# Altium schematic sheet Page10 WIFI&Bluetooth.SchDoc
size 386 x 246 mm
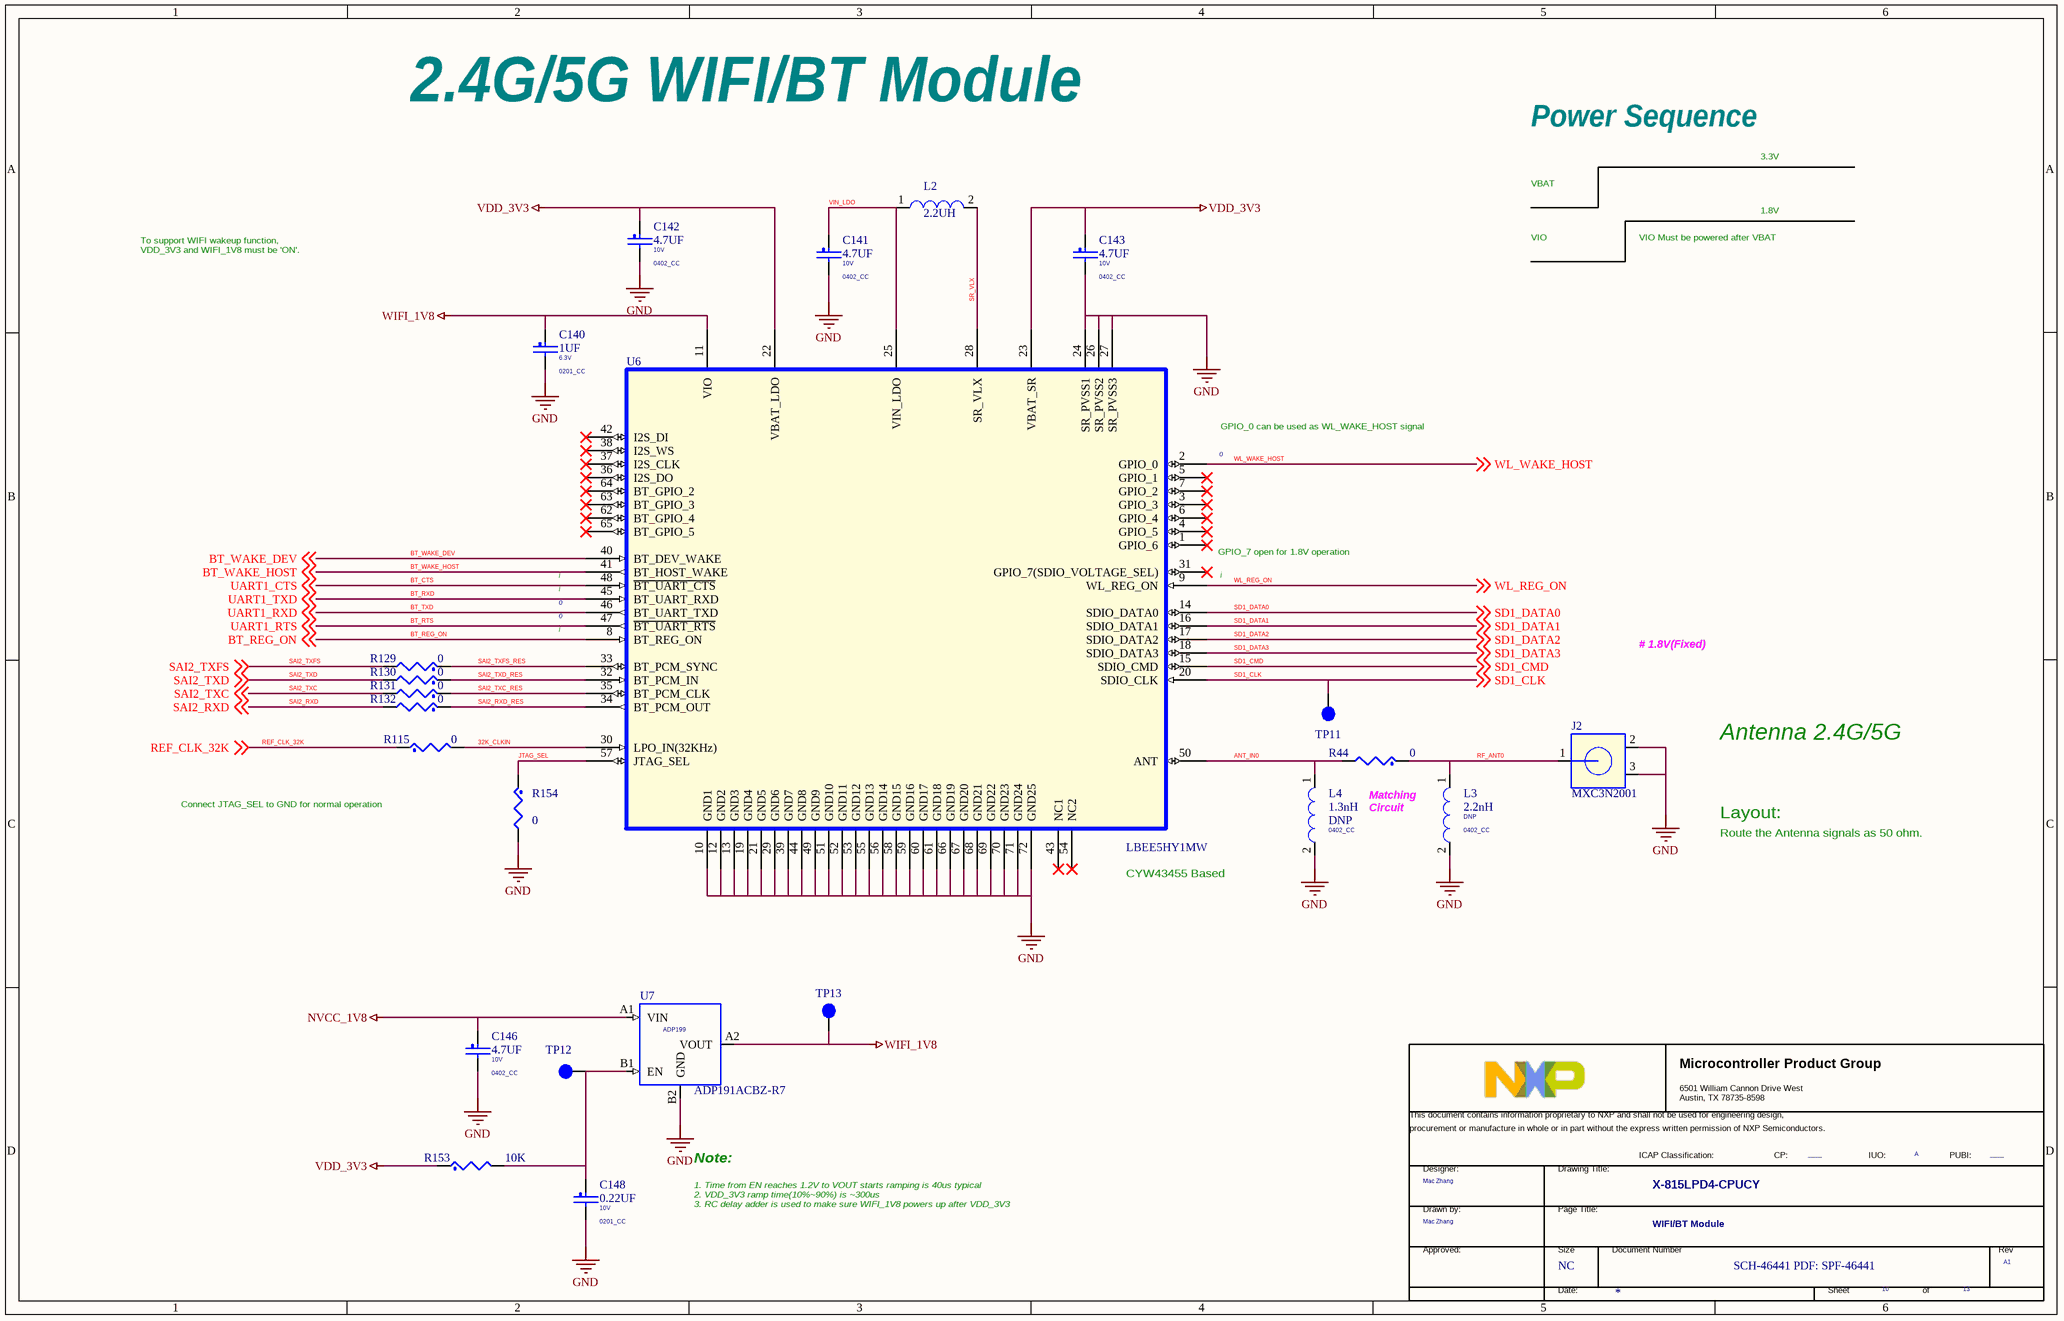
[diagram p0: Page10 WIFI&Bluetooth.SchDoc]

## Parts
*  Doc: SCH-46441 PDF: SPF-46441  RevCode: A1  Title: X-815LPD4-CPUCY  Page Size: NC  Page Number: 10  Page Count: 13  PageTitle: WIFI/BT Module  Designer: Mac Zhang  PUBI: ____  FIUO: A  (hidden comment: TitleBlock_MCPG)  (graphical)
C140  1UF  VOLTAGE: 6.3V  [0201_CC]
C141  4.7UF  VOLTAGE: 10V  [0402_CC]
C142  4.7UF  VOLTAGE: 10V  [0402_CC]
C143  4.7UF  VOLTAGE: 10V  [0402_CC]
C146  4.7UF  VOLTAGE: 10V  [0402_CC]
C148  0.22UF  VOLTAGE: 10V  [0201_CC]
J2  MXC3N2001  [CON_3_UFL_R_SMT]
L2  2.2UH  [IND_0603A]
L3  2.2nH  ASSY_OPT: DNP  [0402_CC]
L4  1.3nH  ASSY_OPT: DNP  [0402_CC]
R44  0  [0402_CC]
R115  0  [0402_CC]
R129  0  [0402_CC]
R130  0  [0402_CC]
R131  0  [0402_CC]
R132  0  [0402_CC]
R153  10K  [0201_CC]
R154  0  [0402_CC]
TP11  TPAD_015  [TPAD_015]  (value not drawn)
TP12  tpad_020  [tpad_020]  (value not drawn)
TP13  tpad_020  [tpad_020]  (value not drawn)
U6  LBEE5HY1MW  [lga72_0p5_7p9x7p3]
U7  ADP191ACBZ-R7  [wlcsp4_0p4_0p8x0p8_smdp]

## Nets
GND: C140.2 C141.2 C142.2 C143.2 C146.2 C148.2 J2.2(GND1) J2.3(GND2) L3.2 L4.2 R154.2 U6.10(GND1) U6.12(GND2) U6.13(GND3) U6.19(GND4) U6.21(GND5) U6.24(SR_PVSS1) U6.26(SR_PVSS2) U6.27(SR_PVSS3) U6.29(GND6) U6.39(GND7) U6.44(GND8) U6.49(GND9) U6.51(GND10) U6.52(GND11) U6.53(GND12) U6.55(GND13) U6.56(GND14) U6.58(GND15) U6.59(GND16) U6.60(GND17) U6.61(GND18) U6.66(GND19) U6.67(GND20) U6.68(GND21) U6.69(GND22) U6.70(GND23) U6.71(GND24) U6.72(GND25) U7.B2(GND)
NVCC_1V8: C146.1 U7.A1(VIN)
VDD_3V3: C142.1 C143.1 R153.1 U6.22(VBAT_LDO) U6.23(VBAT_SR)
WIFI_1V8: C140.1 TP13.1(Pin1) U6.11(VIO) U7.A2(VOUT)
32K_CLKIN: R115.2 U6.30(LPO_IN(32KHz))
ANT_IN0: L4.1 R44.2 U6.50(ANT)
BT_CTS: U6.48(~{BT_UART_CTS}) ; off-sheet UART1_CTS  [also labelled UART1_CTS]
BT_REG_ON: U6.8(BT_REG_ON) ; off-sheet BT_REG_ON
BT_RTS: U6.47(~{BT_UART_RTS}) ; off-sheet UART1_RTS  [also labelled UART1_RTS]
BT_RXD: U6.45(BT_UART_RXD) ; off-sheet UART1_TXD  [also labelled UART1_TXD]
BT_TXD: U6.46(BT_UART_TXD) ; off-sheet UART1_RXD  [also labelled UART1_RXD]
BT_WAKE_DEV: U6.40(BT_DEV_WAKE) ; off-sheet BT_WAKE_DEV
BT_WAKE_HOST: U6.41(BT_HOST_WAKE) ; off-sheet BT_WAKE_HOST
JTAG_SEL: R154.1 U6.57(JTAG_SEL)
REF_CLK_32K: R115.1 ; off-sheet REF_CLK_32K
RF_ANT0: J2.1(CTR) L3.1 R44.1
SAI2_RXD: R132.2 ; off-sheet SAI2_RXD
SAI2_RXD_RES: R132.1 U6.34(BT_PCM_OUT)
SAI2_TXC: R131.2 ; off-sheet SAI2_TXC
SAI2_TXC_RES: R131.1 U6.35(BT_PCM_CLK)
SAI2_TXD: R130.2 ; off-sheet SAI2_TXD
SAI2_TXD_RES: R130.1 U6.32(BT_PCM_IN)
SAI2_TXFS: R129.2 ; off-sheet SAI2_TXFS
SAI2_TXFS_RES: R129.1 U6.33(BT_PCM_SYNC)
SD1_CLK: TP11.1(Pin1) U6.20(SDIO_CLK) ; off-sheet SD1_CLK
SD1_CMD: U6.15(SDIO_CMD) ; off-sheet SD1_CMD
SD1_DATA0: U6.14(SDIO_DATA0) ; off-sheet SD1_DATA0
SD1_DATA1: U6.16(SDIO_DATA1) ; off-sheet SD1_DATA1
SD1_DATA2: U6.17(SDIO_DATA2) ; off-sheet SD1_DATA2
SD1_DATA3: U6.18(SDIO_DATA3) ; off-sheet SD1_DATA3
SR_VLX: L2.2 U6.28(SR_VLX)
VIN_LDO: C141.1 L2.1 U6.25(VIN_LDO)
WL_REG_ON: U6.9(WL_REG_ON) ; off-sheet WL_REG_ON
WL_WAKE_HOST: U6.2(GPIO_0) ; off-sheet WL_WAKE_HOST
NetC148_1: C148.1 R153.2 TP12.1(Pin1) U7.B1(EN)

Not connected (* = marked no-connect by the designer): U6 1(GPIO_6)* 3(GPIO_3)* 4(GPIO_5)* 5(GPIO_1)* 6(GPIO_4)* 7(GPIO_2)* 31(GPIO_7(SDIO_VOLTAGE_SEL))* 36(I2S_DO)* 37(I2S_CLK)* 38(I2S_WS)* 42(I2S_DI)* 43(NC1)* 54(NC2)* 62(BT_GPIO_4)* 63(BT_GPIO_3)* 64(BT_GPIO_2)* 65(BT_GPIO_5)*

## Notes on the sheet
- 2.4G/5G WIFI/BT Module
- VBAT
- Power Sequence
- 3.3V
- To support WIFI wakeup function,
  VDD_3V3 and WIFI_1V8 must be 'ON'.
- VIO
- VIO Must be powered after VBAT
- 1.8V
- (near U6) o
- GPIO_0 can be used as WL_WAKE_HOST signal
- i
- (near U6) GPIO_7 open for 1.8V operation
- o
- # 1.8V(Fixed)
- (near L3) Matching
  Circuit
- Antenna 2.4G/5G
- Layout:
- Connect JTAG_SEL to GND for normal operation
- Route the Antenna signals as 50 ohm.
- (near U6) CYW43455 Based
- 1. Time from EN reaches 1.2V to VOUT starts ramping is 40us typical
  2. VDD_3V3 ramp time(10%~90%) is ~300us
  3. RC delay adder is used to make sure WIFI_1V8 powers up after VDD_3V3
- Note:
- (in symbol ADP199_4P) ADP199
- (in symbol TitleBlock_MCPG) Microcontroller Product Group; 6501 William Cannon Drive West / Austin, TX 78735-8598; This document contains information proprietary to NXP and shall not be used for engineering design,; procurement or manufacture in whole or in part without the express written permission of NXP Semiconductors.; ICAP Classification:; CP:; IUO:; PUBI:; Designer:; Drawing Title:; Drawn by:; Page Title:; Approved:; Size; Document Number; Rev; Date:; Sheet; of

## Library data of the parts
* = TitleBlock_MCPG: OrgName: NXP Semiconductor; OrgAddr1: NO. 192 Liangjing Rd. Pudong New Area, ShangHai; Page Create Date: March  8, 1995; DrawnBy: Mac Zhang; FCP: ____; Page Modify Date: *
C140 = CAP_NP: CAP CER 1uF 6.3V 20% X5R 0201; CLASS: DISCRETE; FPLIST: CC0201,CC0201_HD,0201_CC,0201_CC_012SM_NSP; CAD_APPROVED: Yes; MFG_PN01: 02016D105MAT2A; MFG_NAME01: AVX; AGILE_PN: 150-79407; HEIGHT: 0.35MM; ROHS: Yes; Tolerance: 20%; PCB Footprint: 0201_CC; Package Size: 0201; Package Type: 7¡± reel
C141-C143 C146 = CAP_NP: CAP CER 4.7uF 10V 10% X5R 0402; CLASS: DISCRETE; AGILE_PN: 150-80044; MFG_NAME01: Samsung Electro Mechanics; MFG_PN01: CL05A475KP5NRNC; CAD_APPROVED: Yes; FPLIST: CC0402_25,CC0402_HD,0402_CC; Tolerance: 10%; ROHS: Yes; HEIGHT: 0.65MM; PCB Footprint: 0402_CC
C148 = CAP_NP: CAP CER 0.22UF 10V 20% X5R 0201; CLASS: DISCRETE; AGILE_PN: 150-78815; MFG_NAME01: Taiyo Yuden; MFG_PN01: LMK063BJ224MP-F; CAD_APPROVED: Yes; FPLIST: CC0201,CC0201_HD,0201_CC; Tolerance: 20%; ROHS: Yes; HEIGHT: 0.33MM; PCB Footprint: 0201_CC
J2 = UFL: CON 1 COAX SKT SMT 55H AU; CLASS: IO; AGILE_PN: 211-79898; MFG_NAME01: SHENZHEN ATOM TECHNOLOGY CO.,LTD; CAD_APPROVED: Yes; MFG_PN01: MXC3N2001; ROHS: Yes; HEIGHT: 1.4MM; PCB Footprint: CON_3_UFL_R_SMT
L2 = INDUCTOR: IND -- 2.2UH@1MHZ 1.05A 20% 0603; CLASS: DISCRETE; AGILE_PN: 180-78587; MFG_NAME01: MURATA; MFG_PN01: LQM18PN2R2MGH; Temp_Range: -40C to + 85C; CAD_APPROVED: Yes; FPLIST: IND_0603A,0603_CC; PCB Footprint: IND_0603A; Tolerance: 20%; ROHS: Yes; HEIGHT: 1MM; PART_TYPE: INDUCTOR; Temp Range: -40C to + 85C
L3 = INDUCTOR: IND -- 0.0022UH@100MHZ 300MA 0.0003UH 0402; CLASS: DISCRETE; FPLIST: IND_0402,0402_CC; CAD_APPROVED: Yes; MFG_PN01: LQG15HS2N2S02D; MFG_NAME01: MURATA; AGILE_PN: 180-76426; PCB Footprint: 0402_CC; PART_TYPE: INDUCTOR; HEIGHT: 0.55mm; ROHS: Yes; Tolerance: 0.0003UH; Package Size: 0402
L4 = IND: IND FILM RF 1.3nH@500MHz  280mA 0.1nH 0402; PART_TYPE: INDUCTOR\0402; CLASS: DISCRETE; FPLIST: IND_0402,0402_CC; CAD_APPROVED: Yes; MFG_PN01: LQP15MN1N3B02D; MFG_NAME01: MURATA; AGILE_PN: 180-78445; PCB Footprint: 0402_CC; HEIGHT: 0.45MM; ROHS: Yes; Tolerance: 0.1nH; Package Size: 0402
R44 R115 = RES: RES MF ZERO OHM 1/16W 5% 0402; CLASS: DISCRETE; AGILE_PN: 470-75394; MFG_NAME01: ROHM; MFG_PN01: MCR01MZPJ000; CAD_APPROVED: Yes; HEIGHT: 0.45 MM; Tolerance: 5%; ROHS: Yes; PCB Footprint: 0402_CC; VOLTAGE: 1/16W
R129-R131 = RES: RES MF ZERO OHM 1/16W 5% 0402; CLASS: DISCRETE; AGILE_PN: 470-75394; MFG_NAME01: ROHM; MFG_PN01: MCR01MZPJ000; CAD_APPROVED: Yes; FPLIST: RC0402_25,RC0402_HD,RC0402_X2,0402_CC; TOL: 1%; SIGNAL_MODEL: DEFAULT_RESISTOR_10000OHM_2_1; PCB Footprint: 0402_CC; Tolerance: 5%; ROHS: Yes; HEIGHT: 0.45 MM; VOLTAGE: 1/16W
R132 R154 = RES: RES MF ZERO OHM 1/16W 5% 0402; CLASS: DISCRETE; SIGNAL_MODEL: DEFAULT_RESISTOR_10000OHM_2_1; TOL: 1%; FPLIST: RC0402_25,RC0402_HD,RC0402_X2,0402_CC; CAD_APPROVED: Yes; MFG_PN01: MCR01MZPJ000; MFG_NAME01: ROHM; AGILE_PN: 470-75394; PCB Footprint: 0402_CC; HEIGHT: 0.45 MM; ROHS: Yes; Tolerance: 5%; VOLTAGE: 1/16W
R153 = RES: RES MF 10K 1/20W 5% 0201; CLASS: DISCRETE; FPLIST: RC0201,0201_CC; CAD_APPROVED: Yes; MFG_PN01: RTT01103JTH; MFG_NAME01: RALEC ELECTRONIC CORP; AGILE_PN: 470-79719; HEIGHT: 0.26 MM; ROHS: Yes; Tolerance: 5%; PCB Footprint: 0201_CC
TP11 = TESTLOOP: TEST POINT PAD 15MIL DIA SMT, NO PART TO ORDER; CLASS: IO; ASSY_OPT: DNP; AGILE_PN: 211-76645; MFG_NAME01: NOTACOMPONENT; CAD_APPROVED: Yes; MFG_PN01: NOTACOMPONENT; ROHS: Yes; HEIGHT: 0.1MM; PCB Footprint: TPAD_015
TP12 TP13 = TESTLOOP: TEST POINT PAD 0.5MM DIA SMT, NO PART TO ORDER; CLASS: IO; CAD_APPROVED: Yes; AGILE_PN: 211-77484; HEIGHT: 0.1MM; ROHS: Yes; PCB Footprint: tpad_020
U6 = LBEE5HY1MW_LGA72: IC XCVR WIFI BLUETOOTH MODULE A/B/G/N/AC 1.71-3.46V LGA72; CAD_APPROVED: Yes; PRE_APN: 312-82117; MFG_PN01: LBEE5HY1MW-TEMP; MFG_NAME01: MURATA; AGILE_PN: TMP-WF-34457; CLASS: IC; PCB Footprint: lga72_0p5_7p9x7p3; HEIGHT: 1.1MM; ROHS: Yes
U7 = ADP199_4P: IC HIGH SIDE PWR SW 1.1-3.6V WLCSP4; AGILE_PN: 315-82028; MFG_NAME01: ANALOG DEVICES; Temp_Range: -45 to 85 C; CAD_APPROVED: Yes; CLASS: IC; PCB Footprint: wlcsp4_0p4_0p8x0p8_smdp; MFG_PN01: ADP191ACBZ-R7; ROHS: Yes; HEIGHT: 0.66MM; VOLTAGE: 1.1-3.6V; Temp Range: -45 to 85 C